# EAGLE design thermometre-v3-powersupply (EAGLE 6.1)
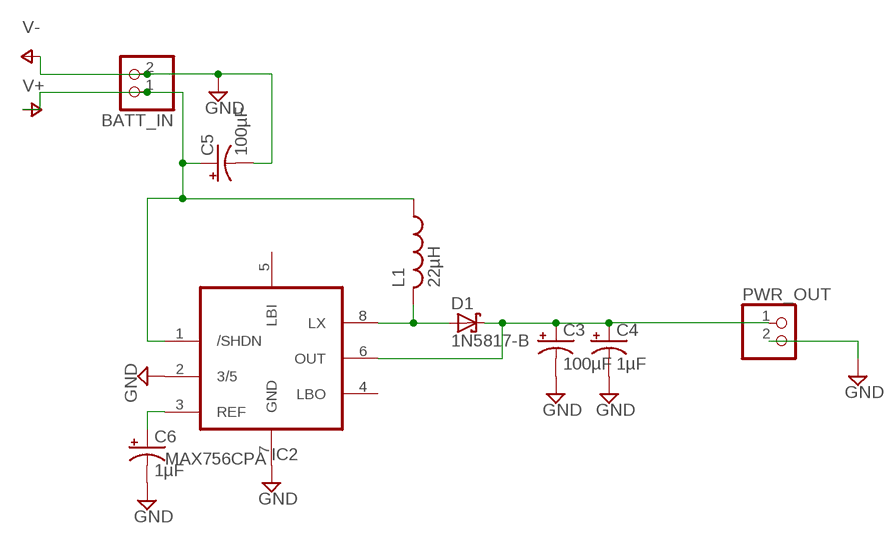
[diagram p0: schematic, sheet 1]

## Parts
BATT_IN  PINHD-1X2  [1X02]
C3  100µF  CPOL-USE2-5  [E2-5]
C4  1µF  CPOL-USE2-5  [E2-5]
C5  100µF  CPOL-USE2.5-5  [E2,5-5]
C6  1µF  CPOL-USE2.5-5  [E2,5-5]
D1  1N5817-B  [DO41-7.6]
IC2  MAX756CPA  [DIL08]
L1  22µH  L-US0204/7  [0204/7]
PWR_OUT  PINHD-1X2  [1X02]

## Nets
+5V: C3.+ C4.+ D1.C IC2.6(OUT) PWR_OUT.1
GND: BATT_IN.2 C3.- C4.- C5.- C6.- IC2.2(3/5) IC2.7(GND) PWR_OUT.2 ; supply symbol labelled V-
N$8: D1.A IC2.8(LX) L1.2
N$11: C6.+ IC2.3(REF)
V+: BATT_IN.1 C5.+ IC2.1(/SHDN) L1.1
Unconnected: IC2.4(LBO) IC2.5(LBI)

## Library data of the parts
BATT_IN PWR_OUT = pinhead:PINHD-1X2: PIN HEADER
C3 C4 = adafruit:CPOL-US: POLARIZED CAPACITOR, American symbol
C5 C6 = rcl:CPOL-US: POLARIZED CAPACITOR, American symbol
D1 = diode:1N581*: 1.0A SCHOTTKY BARRIER RECTIFIER Source: http://www.diodes.com/datasheets/ds23001.pdf
IC2 = adafruit:MAX756
L1 = rcl:L-US: INDUCTOR, American symbol

## Board
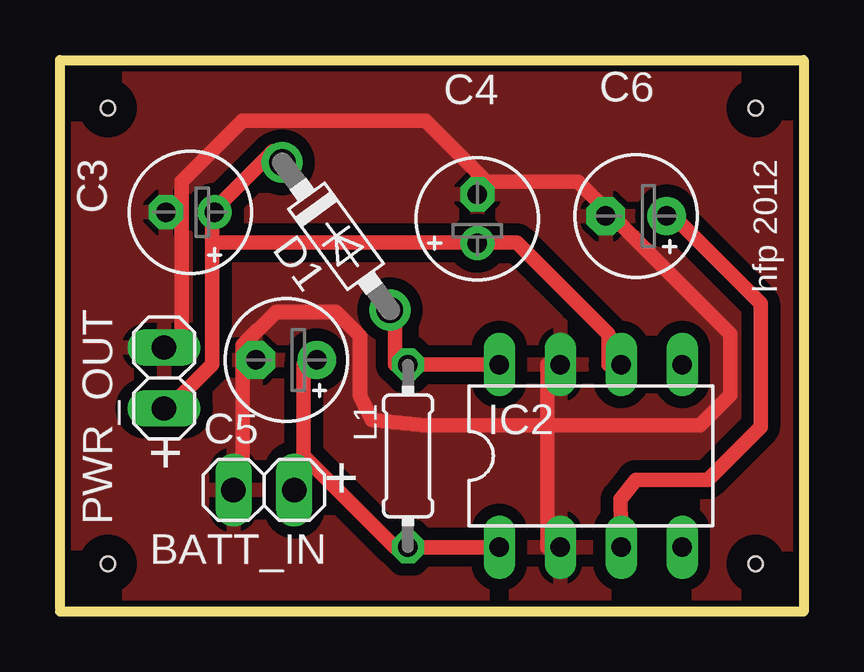
[diagram p1: board, top side]

Size 31 x 23.01 mm. Coordinates in mm from the lower left corner, seen from the top.
Outline: 0,23 0,0.15 0,0 31,0 31,23 0,23
Outline: 0,23 0,23.01
Copper layers (1*16): Top 0.035mm / dielectric 1.5mm / Bottom 0.035mm
Design rules: minimum track width 6mil, minimum drill 12mil, track to track 20mil, track to pad 20mil, pad to pad 20mil, via to via 20mil, smd to smd 0mil, copper to edge 10mil, drill to drill 10mil, minimum pad ring 10mil, minimum via ring 6mil, stop-mask expansion 2mil, vias tented up to drill 100mil, thermal gap 10mil
Holes 0.6 mm at 2,21 2,2 29,21 29,2
tRestrict: area 1,20 to 3,22; area 1,1 to 3,3; area 28,1 to 30,3; area 28,20 to 30,22
bRestrict: area 28,20 to 30,22; area 1,20 to 3,22; area 1,1 to 3,3; area 28,1 to 30,3

### Footprints (pad centres in the part's own frame; a part is rotated, then mirrored left to right if it is on the bottom)
1X02 = drill 1.016 long: 1 -1.27,0; 2 1.27,0
E2-5 = drill 0.813 pad 1.422: + -1.016,0 | drill 0.813 pad 1.422 octagon: - 1.016,0
E2,5-5 = drill 0.813 pad 1.6: + -1.27,0 | drill 0.813 pad 1.6 octagon: - 1.27,0
DO41-7.6 = drill 1.1 pad 1.7: A 3.81,0; C -3.81,0
DIL08 = drill 0.813 long: 1 -3.81,-3.81; 2 -1.27,-3.81; 3 1.27,-3.81; 4 3.81,-3.81; 5 3.81,3.81; 6 1.27,3.81; 7 -1.27,3.81; 8 -3.81,3.81
0204/7 = drill 0.813 octagon: 1 -3.81,0; 2 3.81,0

### Placement (x,y rotation side)
BATT_IN  8.5,5.08 180 top
C3  5.43,16.66 180 top
C4  17.4,16.39 90 top
C5  9.43,10.5 180 top
C6  24.02,16.5 180 top
D1  11.51,15.66 306.1 top
IC2  22.13,6.5 0 top
L1  14.51,6.5 90 top
PWR_OUT  4.34,9.75 90 top

### Tracks (layer width: path | path; a pad name or v marks a point on that pad's centre or on a via)
+5V
  Top 0.254: 8.89,19.2 D1.C | 6.35,16.66 C3.+ | 17.78,15.39 C4.+
  Top 0.61: IC2.6 22.86,10.31 22.86,11.58 19.05,15.39 17.78,15.39 6.35,15.39 | 8.89,19.2 6.35,16.66 6.35,15.39 | 6.35,15.39 6.35,10.31 5.08,9.04 PWR_OUT.1
GND
  Top 0.254: 7.62,5.23 BATT_IN.2 | 5.08,16.66 C3.- | 17.78,17.93 C4.-
  Top 0.61: 20.32,7.77 20.32,10.31 IC2.7 | 20.32,7.77 20.32,2.69 IC2.2 | 7.62,10.31 7.62,5.23 | 20.32,7.77 15.24,7.77 13,8 12.5,9 12.5,11.5 11.5,12.5 9,12.5 7.62,11.12 7.62,10.31 | 7.62,10.31 C5.- | PWR_OUT.2 5.08,11.58 5.08,16.66 5.08,17.93 7.62,20.47 15.24,20.47 17.78,17.93 21.59,17.93 22.86,16.66 | 20.32,7.77 26.67,7.77 27.94,9.04 27.94,11.58 22.86,16.66 | 22.86,16.66 C6.-
  pour Top: -2.5,27 33.5,27 36.5,24 36.5,-2.5 33.5,-5.5 0,-5.5 -6,0.5 -6,23.5
N$8
  Top 0.254: 13.97,12.85 D1.A
  Top 0.61: 13.97,12.85 13.97,10.31 L1.2 IC2.8
N$11
  Top 0.254: 25.4,16.66 C6.+
  Top 0.61: 25.4,16.66 29.21,12.85 29.21,7.71 27,5.5 24,5.5 23.36,4.69 IC2.3
V+
  Top 0.254: 10.16,10.31 C5.+ | 13.97,2.69 L1.1
  Top 0.61: IC2.1 L1.1 | 10.16,10.31 10.16,6.5 | 10.16,6.5 10.16,5.23 BATT_IN.1 10.16,6.5 | 10.16,6.5 13.97,2.69

### Text on the board
tPlace: hfp 2012 | + | +